# Altium schematic sheet Spin_SCH.SchDoc: Блок управления
size 420 x 297 mm; ApprovedBy: Мешков; CheckedBy: Черноскутов; Author: Самойлов; CompanyName: РГППУ; Title2str: моторами; DecimalNumber: АБВГ.123456.001 33
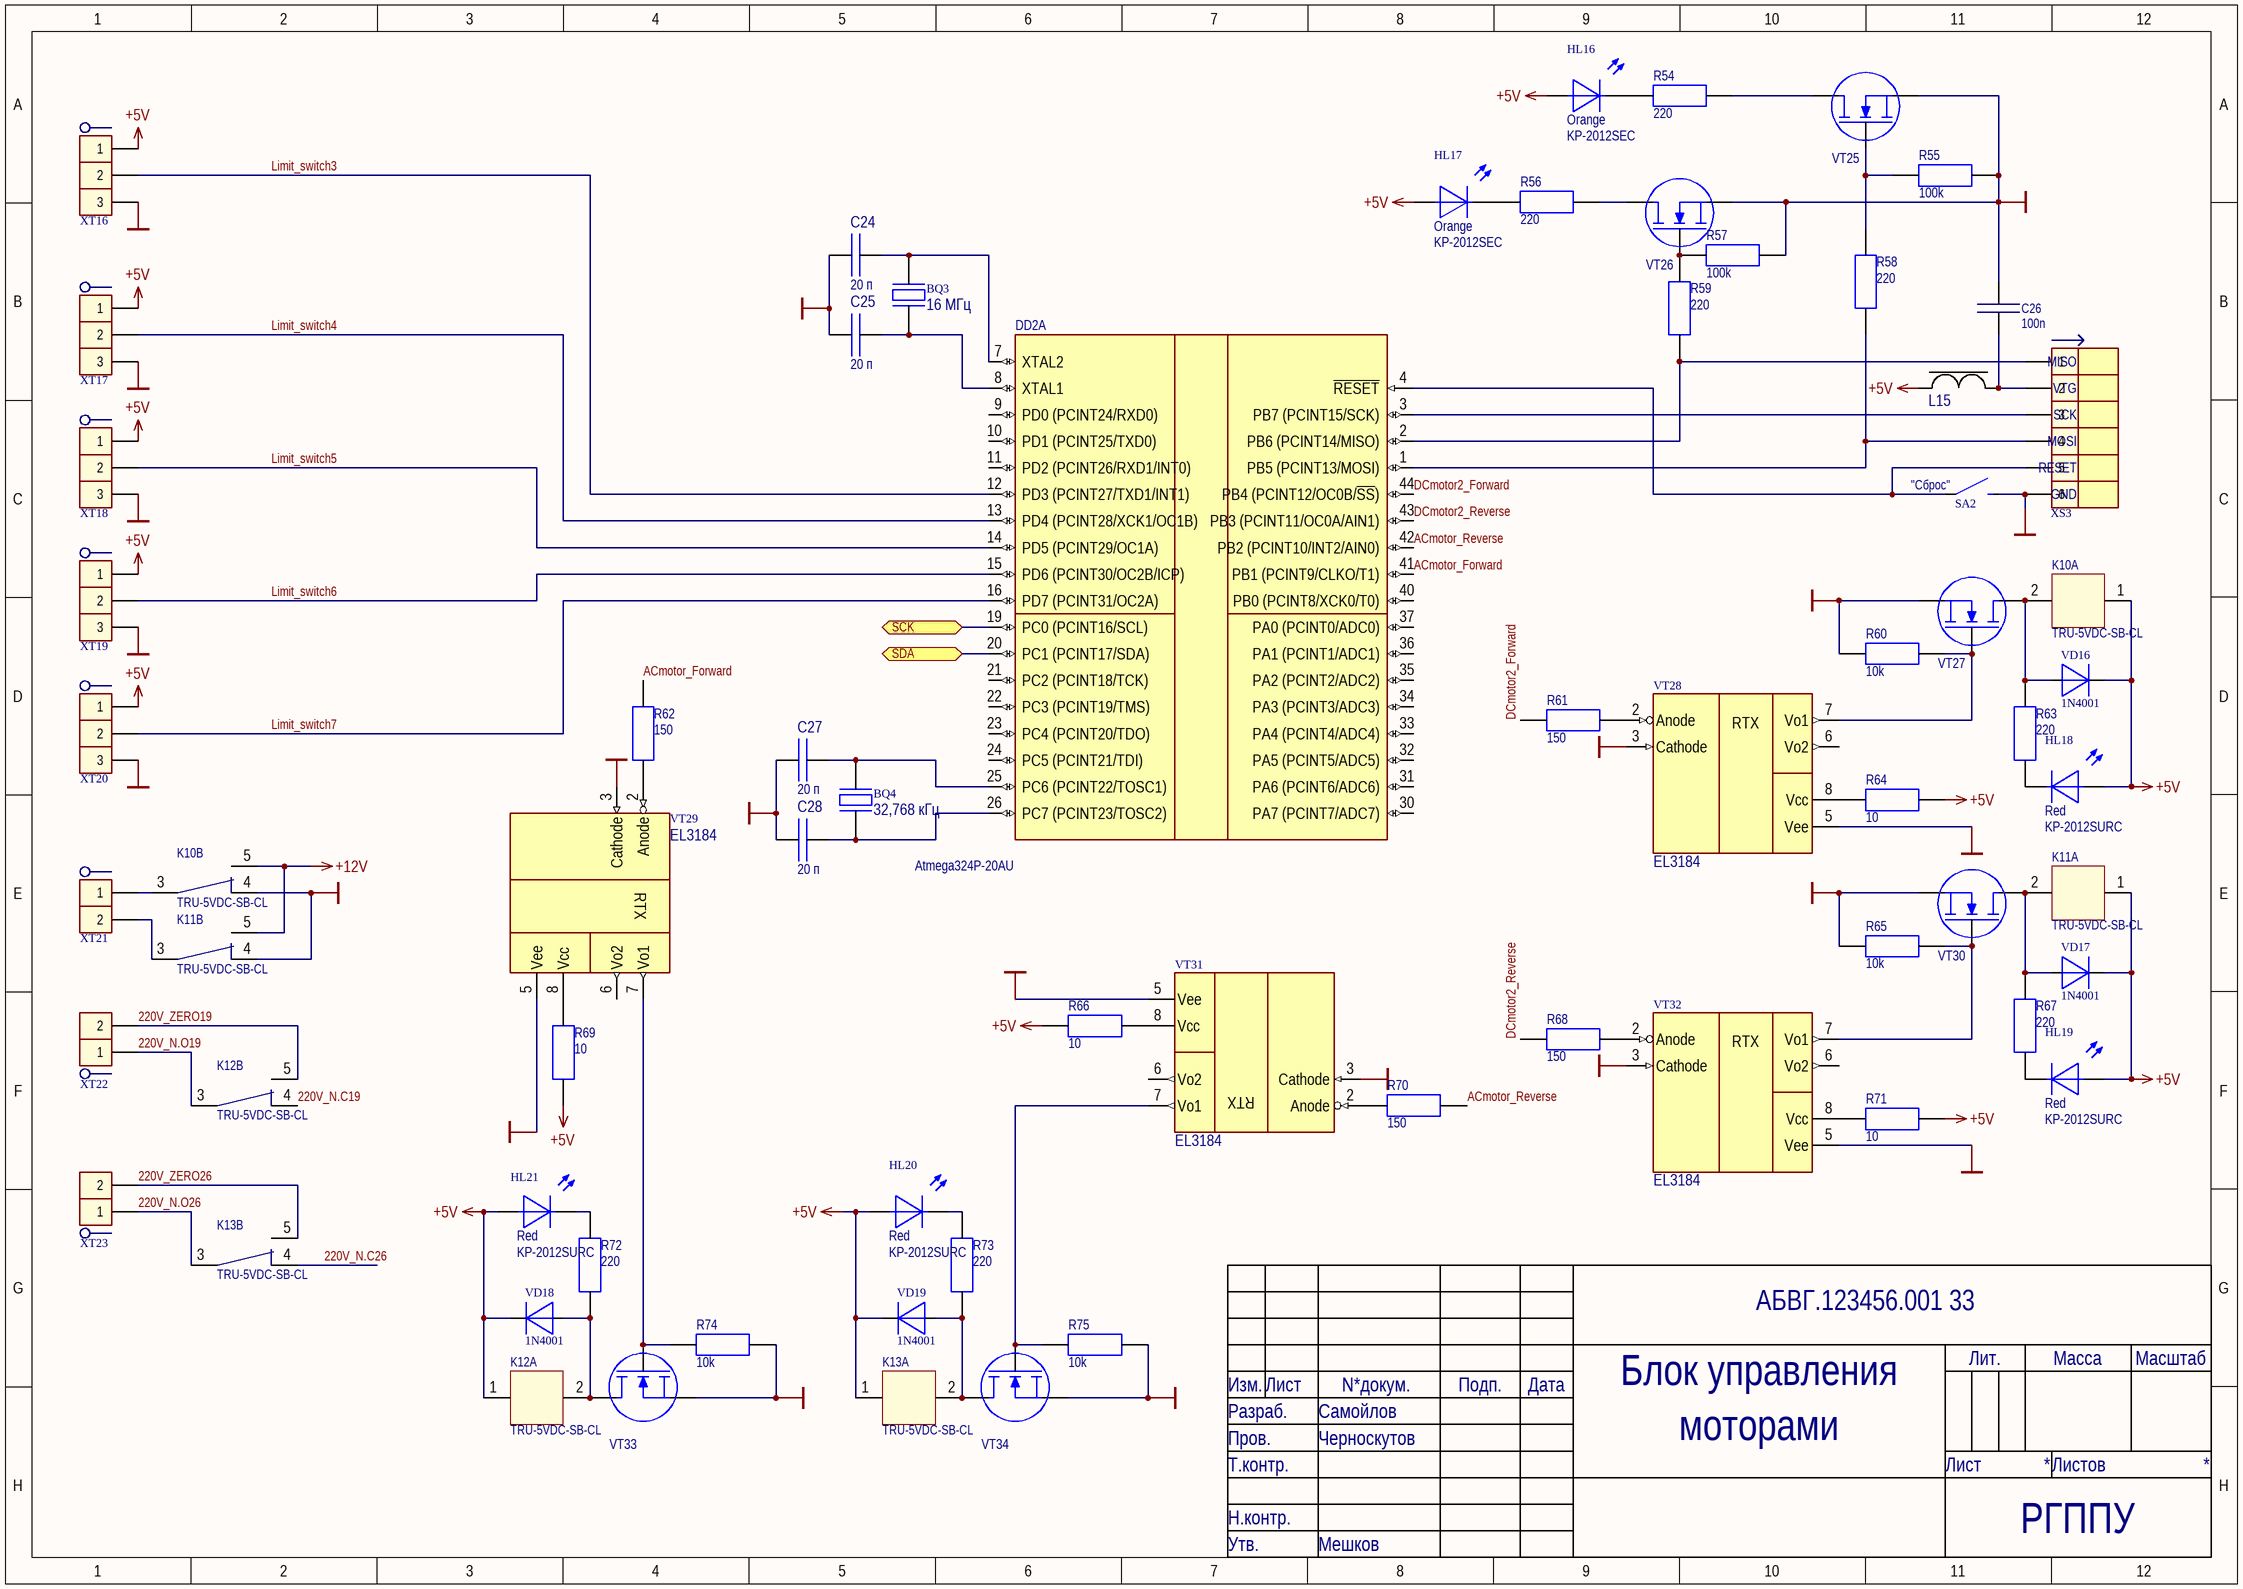
[diagram p0: Spin_SCH.SchDoc]

## Parts
BQ3  16 МГц  [HC-49/S]
BQ4  32,768 кГц  [HC-49/S]
C24  value 20 п  [CAPC3216X05M]  (hidden comment: CC0603JRNP09BN200)
C25  value 20 п  [CAPC3216X05M]  (hidden comment: CC0603JRNP09BN200)
C26  100n  [SMDRC0805]
C27  value 20 п  [CAPC3216X05M]  (hidden comment: CC0603JRNP09BN200)
C28  value 20 п  [CAPC3216X05M]  (hidden comment: CC0603JRNP09BN200)
DD2  Atmega324P-20AU  [44ML_M]  (part A of 2)
HL16  Orange  ManufacturerPartNumber: KP-2012SEC  [DIOMELF2012M]
HL17  Orange  ManufacturerPartNumber: KP-2012SEC  [DIOMELF2012M]
HL18  Red  ManufacturerPartNumber: KP-2012SURC  [DIOMELF2012M]
HL19  Red  ManufacturerPartNumber: KP-2012SURC  [DIOMELF2012M]
HL20  Red  ManufacturerPartNumber: KP-2012SURC  [DIOMELF2012M]
HL21  Red  ManufacturerPartNumber: KP-2012SURC  [DIOMELF2012M]
K10  TRU-5VDC-SB-CL  [TRU-5VDC-SB-CL]  (parts A,B of 2)
K11  TRU-5VDC-SB-CL  [TRU-5VDC-SB-CL]  (parts A,B of 2)
K12  TRU-5VDC-SB-CL  [TRU-5VDC-SB-CL]  (parts A,B of 2)
K13  TRU-5VDC-SB-CL  [TRU-5VDC-SB-CL]  (parts A,B of 2)
L15  MPZ1608S181A  [INDC0603X03M]  (value not drawn)
R54  220  [SMDRC0805]
R55  100k  [SMDRC0805]
R56  220  [SMDRC0805]
R57  100k  [SMDRC0805]
R58  220  [SMDRC0805]
R59  220  [SMDRC0805]
R60  10k  [SMDRC0805]
R61  150  [SMDRC0805]
R62  150  [SMDRC0805]
R63  220  [SMDRC0805]
R64  10  [SMDRC0805]
R65  10k  [SMDRC0805]
R66  10  [SMDRC0805]
R67  220  [SMDRC0805]
R68  150  [SMDRC0805]
R69  10  [SMDRC0805]
R70  150  [SMDRC0805]
R71  10  [SMDRC0805]
R72  220  [SMDRC0805]
R73  220  [SMDRC0805]
R74  10k  [SMDRC0805]
R75  10k  [SMDRC0805]
SA2  DTSM20-4.3  [DTSM20]  (value not drawn)
VD16  1N4001  [PinDiode]
VD17  1N4001  [PinDiode]
VD18  1N4001  [PinDiode]
VD19  1N4001  [PinDiode]
VT25  2N7002  [SOT23 (TO-236AB)]  (value not drawn)
VT26  2N7002  [SOT23 (TO-236AB)]  (value not drawn)
VT27  2N7002  [SOT23 (TO-236AB)]  (value not drawn)
VT28  EL3184  [DIP8]
VT29  EL3184  [DIP8]
VT30  2N7002  [SOT23 (TO-236AB)]  (value not drawn)
VT31  EL3184  [DIP8]
VT32  EL3184  [DIP8]
VT33  2N7002  [SOT23 (TO-236AB)]  (value not drawn)
VT34  2N7002  [SOT23 (TO-236AB)]  (value not drawn)
XS3  IDC-06M  [IDC-06M]  (value not drawn)
XT16  330-031-12  [330-031-12]  (value not drawn)
XT17  330-031-12  [330-031-12]  (value not drawn)
XT18  330-031-12  [330-031-12]  (value not drawn)
XT19  330-031-12  [330-031-12]  (value not drawn)
XT20  330-031-12  [330-031-12]  (value not drawn)
XT21  330-021-12  [330-021-12]  (value not drawn)
XT22  305-021-12  [330-021-12]  (value not drawn)
XT23  305-021-12  [330-021-12]  (value not drawn)

## Ports
SCK (bidir), SDA (bidir)

## Nets
+5V: HL16.1 HL17.1 HL18.1 HL19.1 HL20.1 HL21.1 K10.1 K11.1 K12.1 K13.1 L15.1 R64.2 R66.2 R69.2 R71.2 VD16.K VD17.K VD18.K VD19.K XT16.1 XT17.1 XT18.1 XT19.1 XT20.1
+12V: K10.5 K11.5
GND: C24.2 C25.2 C26.2 C27.2 C28.2 K10.4 K11.4 R55.2 R57.2 R60.2 R65.2 R74.2 R75.2 SA2.2 VT25.2(S) VT26.2(S) VT27.2(S) VT28.3(Cathode) VT28.5(Vee) VT29.3(Cathode) VT29.5(Vee) VT30.2(S) VT31.3(Cathode) VT31.5(Vee) VT32.3(Cathode) VT32.5(Vee) VT33.2(S) VT34.2(S) XS3.6 XT16.3 XT17.3 XT18.3 XT19.3 XT20.3
220V_N.C19: K12.4
220V_N.C26: K13.4
220V_N.O19: K12.3 XT22.1
220V_N.O26: K13.3 XT23.1
220V_ZERO19: K12.5 XT22.2
220V_ZERO26: K13.5 XT23.2
ACmotor_Forward: DD2.41(PB1_(PCINT9/CLKO/T1)) R62.1
ACmotor_Reverse: DD2.42(PB2_(PCINT10/INT2/AIN0)) R70.1
DCmotor2_Forward: DD2.44(PB4_(PCINT12/OC0B/~{SS})) R61.1
DCmotor2_Reverse: DD2.43(PB3_(PCINT11/OC0A/AIN1)) R68.1
Limit_switch3: DD2.12(PD3_(PCINT27/TXD1/INT1)) XT16.2
Limit_switch4: DD2.13(PD4_(PCINT28/XCK1/OC1B)) XT17.2
Limit_switch5: DD2.14(PD5_(PCINT29/OC1A)) XT18.2
Limit_switch6: DD2.15(PD6_(PCINT30/OC2B/ICP)) XT19.2
Limit_switch7: DD2.16(PD7_(PCINT31/OC2A)) XT20.2
SCK: DD2.19(PC0_(PCINT16/SCL)) ; port SCK
SDA: DD2.20(PC1_(PCINT17/SDA)) ; port SDA
NetBQ3_1: BQ3.1 C25.1 DD2.8(XTAL1)
NetBQ3_2: BQ3.2 C24.1 DD2.7(XTAL2)
NetBQ4_1: BQ4.1 C28.1 DD2.26(PC7_(PCINT23/TOSC2))
NetBQ4_2: BQ4.2 C27.1 DD2.25(PC6_(PCINT22/TOSC1))
NetC26_1: C26.1 L15.2 XS3.2
NetDD2_1: DD2.1(PB5_(PCINT13/MOSI)) R58.1 XS3.4
NetDD2_2: DD2.2(PB6_(PCINT14/MISO)) R59.1 XS3.1
NetDD2_3: DD2.3(PB7_(PCINT15/SCK)) XS3.3
NetDD2_4: DD2.4(~{RESET}) SA2.1 XS3.5
NetHL16_2: HL16.2 R54.2
NetHL17_2: HL17.2 R56.2
NetHL18_2: HL18.2 R63.2
NetHL19_2: HL19.2 R67.2
NetHL20_2: HL20.2 R73.2
NetHL21_2: HL21.2 R72.2
NetK10_2: K10.2 R63.1 VD16.A VT27.3(D)
NetK10_3: K10.3 XT21.1
NetK11_2: K11.2 R67.1 VD17.A VT30.3(D)
NetK11_3: K11.3 XT21.2
NetK12_2: K12.2 R72.1 VD18.A VT33.3(D)
NetK13_2: K13.2 R73.1 VD19.A VT34.3(D)
NetR54_1: R54.1 VT25.3(D)
NetR55_1: R55.1 R58.2 VT25.1(G)
NetR56_1: R56.1 VT26.3(D)
NetR57_1: R57.1 R59.2 VT26.1(G)
NetR60_1: R60.1 VT27.1(G) VT28.7(Vo1)
NetR61_2: R61.2 VT28.2(Anode)
NetR62_2: R62.2 VT29.2(Anode)
NetR64_1: R64.1 VT28.8(Vcc)
NetR65_1: R65.1 VT30.1(G) VT32.7(Vo1)
NetR66_1: R66.1 VT31.8(Vcc)
NetR68_2: R68.2 VT32.2(Anode)
NetR69_1: R69.1 VT29.8(Vcc)
NetR70_2: R70.2 VT31.2(Anode)
NetR71_1: R71.1 VT32.8(Vcc)
NetR74_1: R74.1 VT29.7(Vo1) VT33.1(G)
NetR75_1: R75.1 VT31.7(Vo1) VT34.1(G)

Not connected (* = marked no-connect by the designer): DD2 9(PD0_(PCINT24/RXD0)) 10(PD1_(PCINT25/TXD0)) 11(PD2_(PCINT26/RXD1/INT0)) 21(PC2_(PCINT18/TCK)) 22(PC3_(PCINT19/TMS)) 23(PC4_(PCINT20/TDO)) 24(PC5_(PCINT21/TDI)) 30(PA7_(PCINT7/ADC7)) 31(PA6_(PCINT6/ADC6)) 32(PA5_(PCINT5/ADC5)) 33(PA4_(PCINT4/ADC4)) 34(PA3_(PCINT3/ADC3)) 35(PA2_(PCINT2/ADC2)) 36(PA1_(PCINT1/ADC1)) 37(PA0_(PCINT0/ADC0)) 40(PB0_(PCINT8/XCK0/T0)); VT28 6(Vo2); VT29 6(Vo2); VT31 6(Vo2); VT32 6(Vo2)

## Notes on the sheet
- (near SA2) "Сброс"
- Изм.
- Лист
- N*докум.
- Подп.
- Дата
- Лит.
- Масса
- Масштаб
- Разраб.
- Пров.
- Т.контр.
- Лиcт
- Лиcтов
- Н.контр.
- Утв.
- (in symbol Con6_M IDC-06M_SPI) MISO; VTG; SCK; MOSI; RESET; GND
- (in symbol EL3184) RTX

## Library data of the parts
BQ3 BQ4 = Piezoelectric_16000: Piezoelectric elements; Manufacturer: Taizhou; ManufacturerPartNumber: 16000 кГц 20ppm 20pF; ComponentLink1URL: http://www.promelec.ru/catalog_info/54/126/246/70/; ComponentLink1Description: Datasheet; Package: HC-49/S; Cost: 8,54; Supplier: Промэлектроника; ComponentLink2Description: Datasheet-local
  BQ3: Value: 16 МГц
  BQ4: Value: 32,768 кГц
C24 C25 C27 C28 = p00020_050: 20pF Bipolar cap; Manufacturer: Yageo; ManufacturerPartNumber: CC0603JRNP09BN200; Supplier: Промэлектроника; Cost: 0,34; Package: 0603; ComponentLink1Description: Datasheet; ComponentLink1URL: http://www.yageo.com/documents/recent/UPY-GPHC_X5R_4V-to-50V_v16.pdf; ComponentLink2Description: Datasheet-local; ComponentLink2URL: *
C26 = Capacitor 0805 100n: Generic capasitor non-polar; PartNumber: Capacitor 0805 100n; Value: 100n; ComponentLink1Description: Datasheet; Package: 0805
DD2 = Atmega324P-20AU: Microcontroller 8-bit; Manufacturer: Atmel; ComponentLink1URL: http://www.atmel.com/Images/Atmel-8011-8-bit-AVR-Microcontroller-ATmega164P-324P-644P_datasheet.pdf; ComponentLink1Description: Datasheet; Cost: 220; Package: TQFP-44; Supplier: Промэлектроника; ManufacturerPartNumber: Atmega324P-20AU
HL16 HL17 = LED1_O: Diod LED SMD Orange; ComponentLink1Description: Datasheet; Cost: 4,91; ComponentLink2Description: Datasheet-local; ComponentLink2URL: *; Color: Orange
HL18-HL21 = LED1_R: Diod LED SMD Red; ComponentLink1Description: Datasheet; Cost: 5,01; ComponentLink2Description: Datasheet-local; ComponentLink2URL: *; Color: Red
L15 = Ferrite Bead: Value: ? мГн; ManufacturerPartNumber: MPZ1608S181A; ComponentLink1Description: Datasheet; Supplier: Промэлектроника; ComponentLink2Description: Datasheet-local; ComponentLink2URL: *
R54 R56 R58 R59 R63 R67 R72 R73 = Resistor 0805 220: Generic resistor; PartNumber: Resistor 0805 220; Value: 220; ComponentLink1URL: http://www.mouser.com/ds/2/447/PYu-RC0402_51_RoHS_L_6_r-8721.pdf; ComponentLink1Description: Datasheet; Package: 0805
R55 R57 = Resistor 0805 100k: Generic resistor; PartNumber: Resistor 0805 100k; Value: 100k; ComponentLink1URL: http://www.mouser.com/ds/2/447/PYu-RC0402_51_RoHS_L_6_r-8721.pdf; ComponentLink1Description: Datasheet; Package: 0805
R60 R65 R74 R75 = Resistor 0805 10k: Generic resistor; PartNumber: Resistor 0805 10k; Value: 10k; ComponentLink1URL: http://www.mouser.com/ds/2/447/PYu-RC0402_51_RoHS_L_6_r-8721.pdf; ComponentLink1Description: Datasheet; Package: 0805
R61 R62 R68 R70 = Resistor 0805 150: Generic resistor; PartNumber: Resistor 0805 150; Value: 150; ComponentLink1URL: http://www.mouser.com/ds/2/447/PYu-RC0402_51_RoHS_L_6_r-8721.pdf; ComponentLink1Description: Datasheet; Package: 0805
R64 R66 R69 R71 = Resistor 0805 10: Generic resistor; PartNumber: Resistor 0805 10; Value: 10; ComponentLink1URL: http://www.mouser.com/ds/2/447/PYu-RC0402_51_RoHS_L_6_r-8721.pdf; ComponentLink1Description: Datasheet; Package: 0805
SA2 = Switch1_DTSM20-4.3: Switch open; Manufacturer: Diptronics; ManufacturerPartNumber: DTSM20-4.3; ComponentLink1Description: Datasheet; ComponentLink1URL: http://www.promelec.ru/catalog/407/1291/1323/1/70721/; ComponentLink2Description: Datasheet-local; ComponentLink2URL: *
VD16-VD19 = 1N4001: Rectifying diode; ComponentLink1Description: Datasheet; ComponentLink1URL: http://www.promelec.ru/pdf/1N400x.pdf; Cost: 5; Package: штырьевой; ComponentLink2Description: Datasheet-local; ComponentLink2URL: *; ManufacturerPartNumber: 1N4001
VT25-VT27 VT30 VT33 VT34 = 2N7002 n-MOSFET: 60V, 300mA N-channel Trench MOSFET; ManufacturerPartNumber: 2N7002
VT28 VT29 VT31 VT32 = EL3184: Optocouple IGBT driver; Manufacturer: Everlight Electronics Co. Ltd; Package: DIP-8; ComponentLink1URL: http://www.promelec.ru/pdf/EL3184-EVLT.pdf; ComponentLink1Description: Datasheet; Cost: 66,38; Supplier: Промэлектроника; ManufacturerPartNumber: EL3184
XS3 = Con6_M IDC-06M_SPI: SPI connector; ManufacturerPartNumber: IDC-06M; ComponentLink1Description: Datasheet; ComponentLink1URL: http://www.promelec.ru/catalog/406/1218/1223/1/156430/; ComponentLink2Description: Datasheet-local; ComponentLink2URL: *
XT16-XT20 = Con3_D 330-031-12: Demountable connection 3-pin; Manufacturer: Degson Electronics Co., Ltd; ManufacturerPartNumber: 330-031-12; ComponentLink1Description: Datasheet; Cost: 13; Supplier: Промэлектроника; ComponentLink2Description: Datasheet-local
XT21 = Con2_D 330-021-12: Demountable connection  2-pin; Manufacturer: Degson Electronics Co., Ltd; ManufacturerPartNumber: 330-021-12; ComponentLink1Description: Datasheet; Cost: 7,45; Supplier: Промэлектроника; ComponentLink2Description: Datasheet-local
XT22 XT23 = Con2_D 305-021-12: Demountable connection  2-pin; Manufacturer: Degson Electronics Co., Ltd; ManufacturerPartNumber: 305-021-12; ComponentLink1Description: Datasheet; Cost: 7,45; Supplier: Промэлектроника; ComponentLink2Description: Datasheet-local
K10-K13 = TRU-5VDC-SB-CL: ManufacturerPurtNumber: TRU-5VDC-SB-CL